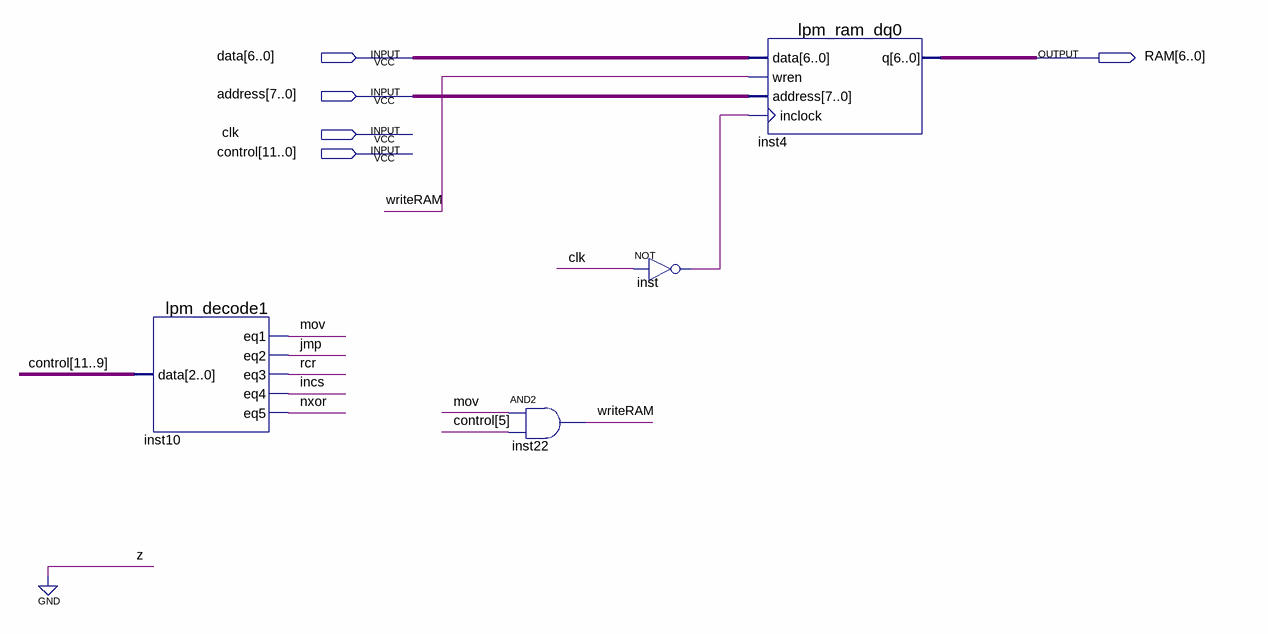
[diagram p0: schematic sheet]
// Quartus schematic RAM.bdf as structural Verilog: 4 symbols, 5 pins
module RAM (
  input  [6:0] data,
  input  [7:0] address,
  input  clk,
  input  [11:0] control,
  output [6:0] RAM
);

  wire incs, inst_out, jmp, mov, nxor, rcr, writeRAM;

  lpm_decode1 inst10 (.data(control[11:9]), .eq1(mov), .eq2(jmp), .eq3(rcr), .eq4(incs), .eq5(nxor));
  and inst22 (writeRAM, mov, control[5]);
  not inst (inst_out, clk);
  lpm_ram_dq0 inst4 (.data(data), .wren(writeRAM), .address(address), .inclock(inst_out), .q(RAM));
endmodule
